# EAGLE design main2 (EAGLE 8.6.3)
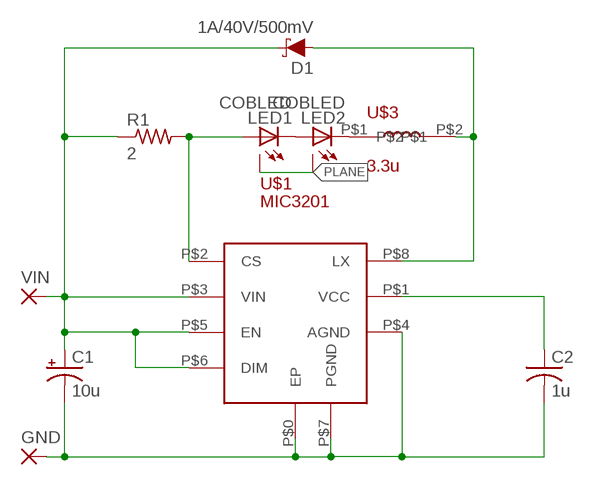
[diagram p0: schematic, sheet 1]

## Parts
C1  10u  CPOL-USE2-5  [E2-5]
C2  1u  C-USC0805  [C0805]
D1  1A/40V/500mV  DIODE-SCHOTTKY-SS14  [SMA-DIODE]
GND  2,54/1,0  [2,54/1,0]
LED1  COBLED  [COBLED]
LED2  COBLED  [COBLED]
R1  2  R-US_R0805  [R0805]
U$1  MIC3201  [SOICNEP-8LD-LP-1]
U$3  3.3u  DO1813H  [DO1813H]
VIN  2,54/1,0  [2,54/1,0]

## Nets
N$1: LED1.P$2(C) LED2.P$1(A)
N$2: C1.- C2.2 GND.1(P) U$1.P$0(EP) U$1.P$4(AGND) U$1.P$7(PGND)
N$3: C1.+ D1.C R1.1 U$1.P$3(VIN) U$1.P$5(EN) U$1.P$6(DIM) VIN.1(P)
N$4: C2.1 U$1.P$1(VCC)
N$5: LED1.P$1(A) R1.2 U$1.P$2(CS)
N$6: D1.A U$1.P$8(LX) U$3.P$2
N$7: LED2.P$2(C) U$3.P$1
PLANE: LED1.P$3(A1) LED2.P$3(A1)

## Library data of the parts
C1 = rcl:CPOL-US: POLARIZED CAPACITOR, American symbol; SPICEPREFIX: C
C2 = rcl:C-US: CAPACITOR, American symbol; SPICEPREFIX: C
D1 = SparkFun-DiscreteSemi:DIODE-SCHOTTKY: Schottky diode A Schottky diode is a semiconductor diode which has a low forward voltage drop and a very fast switching action.; PROD_ID: DIO-08053
GND = 7_segment_lib:2,54/1,0: THROUGH-HOLE PAD
LED1 LED2 = 7_segment_lib:COBLED
R1 = resistor:R-US_: RESISTOR, American symbol
U$1 = Micrel_By_element14_Batch_1:MIC3201
U$3 = 7_segment_lib:DO1813H
VIN = 7_segment_lib:2,54/1,0: THROUGH-HOLE PAD; SPICEPREFIX: X

## Board
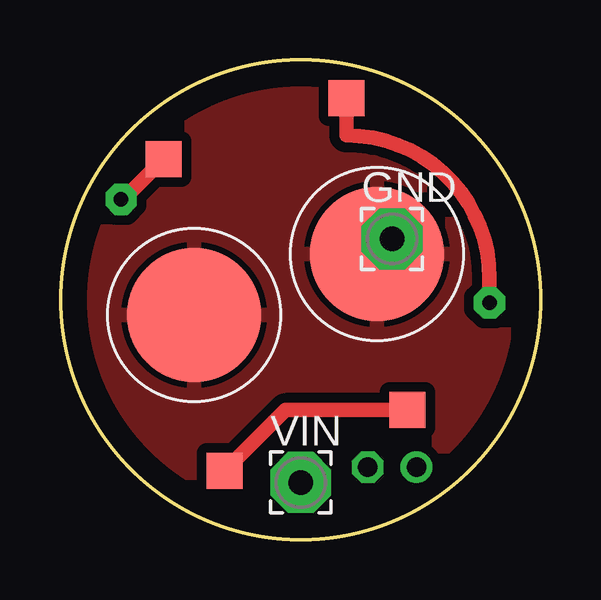
[diagram p1: board, top side]
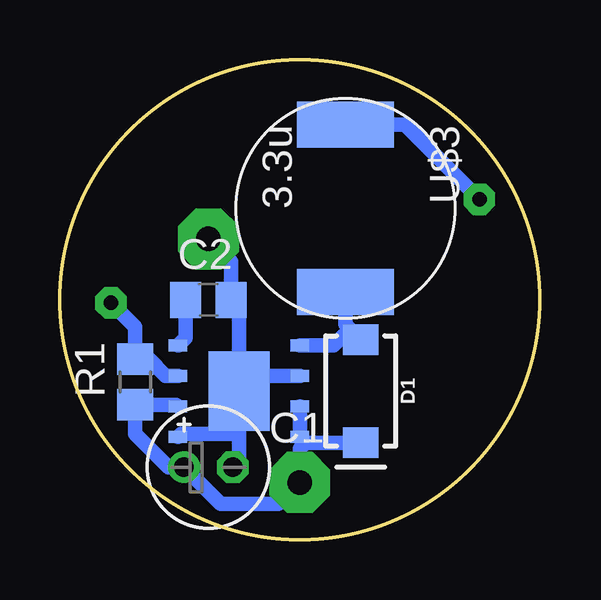
[diagram p2: board, bottom side, seen from below]

Size 20 x 20 mm. Coordinates in mm from the lower left corner, seen from the top.
Outline: circle at 10,10 radius 10
Copper layers (1*16): Top 0.035mm / dielectric 1.5mm / Bottom 0.035mm
Design rules "default": minimum track width 6mil, minimum drill 0.35mm, track to track 6mil, track to pad 6mil, pad to pad 6mil, via to via 6mil, smd to smd 6mil, copper to edge 40mil, drill to drill 6mil, minimum pad ring 10mil, minimum via ring 8mil, stop-mask expansion 4mil, vias tented up to drill 0mil, thermal gap 10mil

### Footprints (pad centres in the part's own frame; a part is rotated, then mirrored left to right if it is on the bottom)
E2-5 = drill 0.813 pad 1.27: + -1.016,0 | drill 0.813 pad 1.27 octagon: - 1.016,0
C0805 = smd 1.3 x 1.5: 1 -0.95,0; 2 0.95,0
SMA-DIODE = smd 1.27 x 1.47: A -2.15,0; C 2.15,0
2,54/1,0 = drill 1.016 pad 2.54 octagon: 1 0,0
COBLED = smd 1.5 x 1.5: P$1 -6.5,-1.27; P$2 6.5,1.27 | smd 5.6 x 5.6: P$3 0,0
R0805 = smd 1.3 x 1.5: 1 -0.95,0; 2 0.95,0
SOICNEP-8LD-LP-1 = smd 2.54 x 3.302: P$0 0,0 | smd 0.762 x 0.508: P$1 -2.54,1.905; P$2 -2.54,0.635; P$3 -2.54,-0.635; P$4 -2.54,-1.905; P$5 2.54,-1.905; P$6 2.54,-0.635; P$7 2.54,0.635; P$8 2.54,1.905
DO1813H = smd 1.91 x 4.06: P$1 -3.49,0; P$2 3.49,0

### Placement (x,y rotation side)
C1  13.81,3.01 0 bottom
C2  13.81,10 0 bottom
D1  7.46,6.19 270 bottom
GND  13.81,12.54 0 top
LED1  13.18,11.91 270 top
LED2  5.55,9.37 90 top
R1  16.86,6.57 90 bottom
U$1  12.54,6.19 0 bottom
U$3  8.1,13.81 270 bottom
VIN  10,2.38 0 top

### Tracks (layer width: path | path; a pad name or v marks a point on that pad's centre or on a via)
N$1
  Top 0.61: LED1.P$2 9.37,5.4 LED2.P$1
N$2
  Bottom 0.61: U$1.P$7 11.91,6.83 U$1.P$0 | U$1.P$0 12.54,9.68 C2.2 12.86,11.59 GND.1 | 12.54,4.41 12.54,3.27 C1.- | 12.54,4.41 U$1.P$0 | U$1.P$4 14.95,4.41 12.54,4.41
N$3
  Bottom 0.61: U$1.P$6 U$1.P$5 9.76,4.04 | U$1.P$3 15.15,5.62 R1.1 16.86,4.41 15.46,3.01 C1.+ 13.3,1.49 10.89,1.49 VIN.1 10,3.79 9.76,4.04 | D1.C 9.76,4.04
N$4
  Bottom 0.61: U$1.P$1 14.76,8.41 C2.1
N$5  (via drill 0.6 pad 1.3)
  Top 0.61: v17.87,9.87 17.87,10.89 arc90 11.91,16.86 LED1.P$1
  Bottom 0.61: U$1.P$2 15.59,6.83 16.28,7.52 R1.2 16.86,8.86 v17.87,9.87
N$6
  Bottom 0.61: U$3.P$2 8.1,8.97 7.91,8.79 | 7.91,8.79 D1.A | U$1.P$8 8.6,8.1 7.91,8.79
N$7  (via drill 0.6 pad 1.3)
  Top 0.61: LED2.P$2 2.61,14.19 v2.51,14.19
  Bottom 0.61: U$3.P$1 5.62,17.3 v2.51,14.19
PLANE
  pour Top (isolate 0.406): 10.13,-0.03 10.25,-0.03 arc90 20.16,9.87 20.16,10 arc90 10.13,20.03 10,20.03 arc90 -0.41,9.62 -0.41,9.37 arc90 9.62,-0.67 9.62,-0.54 arc-90